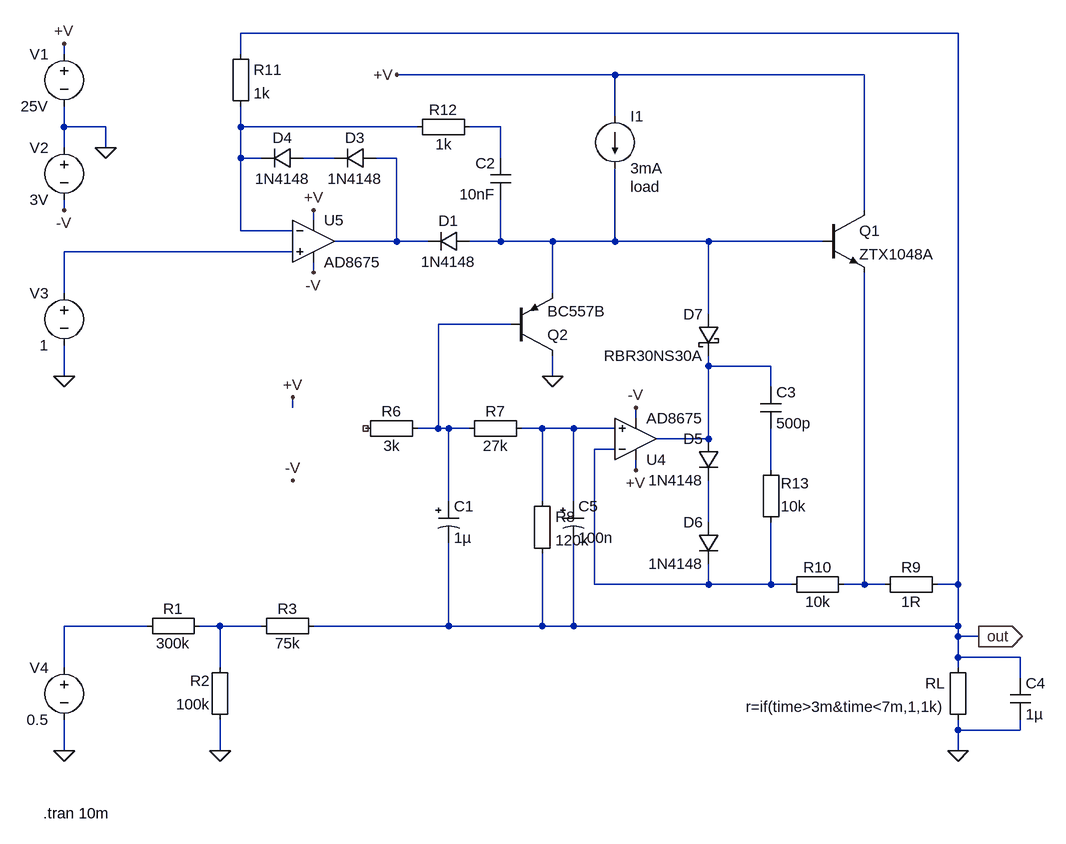
[diagram p0: schematic PSU CV CI high side I ref_ad8476.asc]
PSU CV CI high side I ref_ad8476.asc, the LTspice schematic file:
Version 4
SHEET 1 1452 1084
WIRE 1264 -208 160 -208
WIRE -112 -176 -112 -192
WIRE 160 -176 160 -208
WIRE 736 -144 400 -144
WIRE 1120 -144 736 -144
WIRE 736 -80 736 -144
WIRE -112 -64 -112 -96
WIRE -48 -64 -112 -64
WIRE 160 -64 160 -96
WIRE 432 -64 160 -64
WIRE 560 -64 512 -64
WIRE -112 -32 -112 -64
WIRE -48 -32 -48 -64
WIRE 160 -16 160 -64
WIRE 192 -16 160 -16
WIRE 304 -16 256 -16
WIRE 400 -16 368 -16
WIRE 560 -16 560 -64
WIRE -112 64 -112 48
WIRE 1120 64 1120 -144
WIRE 272 80 272 64
WIRE 160 96 160 -16
WIRE 240 96 160 96
WIRE 400 112 400 -16
WIRE 400 112 304 112
WIRE 448 112 400 112
WIRE 560 112 560 48
WIRE 560 112 512 112
WIRE 640 112 560 112
WIRE 736 112 736 0
WIRE 736 112 640 112
WIRE 880 112 736 112
WIRE 1056 112 880 112
WIRE 240 128 -112 128
WIRE 272 160 272 144
WIRE -112 192 -112 128
WIRE 640 192 640 112
WIRE 880 224 880 112
WIRE 576 240 464 240
WIRE 880 304 880 288
WIRE 976 304 880 304
WIRE -112 320 -112 272
WIRE 640 320 640 288
WIRE 976 336 976 304
WIRE 240 368 240 352
WIRE 768 384 768 368
WIRE 464 400 464 240
WIRE 464 400 432 400
WIRE 480 400 464 400
WIRE 512 400 480 400
WIRE 624 400 592 400
WIRE 672 400 624 400
WIRE 736 400 672 400
WIRE 880 416 880 304
WIRE 880 416 800 416
WIRE 736 432 704 432
WIRE 768 464 768 448
WIRE 976 464 976 400
WIRE 480 512 480 400
WIRE 624 512 624 400
WIRE 672 512 672 400
WIRE 880 544 880 480
WIRE 704 640 704 432
WIRE 880 640 880 608
WIRE 880 640 704 640
WIRE 976 640 976 544
WIRE 976 640 880 640
WIRE 1008 640 976 640
WIRE 1120 640 1120 160
WIRE 1120 640 1088 640
WIRE 1152 640 1120 640
WIRE 1264 640 1264 -208
WIRE 1264 640 1232 640
WIRE 16 704 -112 704
WIRE 128 704 96 704
WIRE 192 704 128 704
WIRE 480 704 480 576
WIRE 480 704 272 704
WIRE 624 704 624 592
WIRE 624 704 480 704
WIRE 672 704 672 576
WIRE 672 704 624 704
WIRE 1264 704 1264 640
WIRE 1264 704 672 704
WIRE 1264 720 1264 704
WIRE 1296 720 1264 720
WIRE 1264 752 1264 720
WIRE 1360 752 1264 752
WIRE -112 768 -112 704
WIRE 128 768 128 704
WIRE 1264 768 1264 752
WIRE 1360 784 1360 752
WIRE 1264 864 1264 848
WIRE 1360 864 1360 848
WIRE 1360 864 1264 864
WIRE -112 896 -112 848
WIRE 128 896 128 848
WIRE 1264 896 1264 864
FLAG -48 -32 0
FLAG -112 -192 +V
FLAG 272 64 +V
FLAG 400 -144 +V
FLAG -112 320 0
FLAG 240 352 +V
FLAG -112 896 0
FLAG 640 320 0
FLAG 768 464 +V
FLAG 1264 896 0
FLAG 128 896 0
FLAG -112 64 -V
FLAG 240 480 -V
FLAG 272 160 -V
FLAG 768 368 -V
FLAG 1296 720 out
IOPIN 1296 720 Out
SYMBOL npn 1056 64 R0
SYMATTR InstName Q1
SYMATTR Value ZTX1048A
SYMBOL voltage -112 -192 M0
WINDOW 123 0 0 Left 0
WINDOW 39 0 0 Left 0
SYMATTR InstName V1
SYMATTR Value 25V
SYMBOL Misc\\EuropeanResistor 1136 656 R270
WINDOW 0 27 56 VTop 2
WINDOW 3 5 56 VBottom 2
SYMATTR InstName R9
SYMATTR Value 1R
SYMBOL voltage -112 176 M0
WINDOW 123 0 0 Left 0
WINDOW 39 0 0 Left 0
SYMATTR InstName V3
SYMATTR Value 1
SYMBOL Misc\\EuropeanResistor 112 688 R90
WINDOW 0 5 56 VBottom 2
WINDOW 3 27 56 VTop 2
SYMATTR InstName R1
SYMATTR Value 300k
SYMBOL Misc\\EuropeanResistor 176 720 R270
WINDOW 0 27 56 VTop 2
WINDOW 3 5 56 VBottom 2
SYMATTR InstName R3
SYMATTR Value 75k
SYMBOL Misc\\EuropeanPolcap 464 512 R0
SYMATTR InstName C1
SYMATTR Value 1µ
SYMATTR SpiceLine Rser=100m
SYMBOL voltage -112 752 M0
WINDOW 123 0 0 Left 0
WINDOW 39 0 0 Left 0
SYMATTR InstName V4
SYMATTR Value 0.5
SYMBOL Misc\\EuropeanResistor 336 416 R270
WINDOW 0 27 56 VTop 2
WINDOW 3 5 56 VBottom 2
SYMATTR InstName R6
SYMATTR Value 3k
SYMBOL Misc\\EuropeanResistor 608 384 R90
WINDOW 0 5 56 VBottom 2
WINDOW 3 27 56 VTop 2
SYMATTR InstName R7
SYMATTR Value 27k
SYMBOL Misc\\EuropeanResistor 608 496 R0
SYMATTR InstName R8
SYMATTR Value 120k
SYMBOL pnp 576 288 M180
WINDOW 0 56 32 Left 2
WINDOW 3 56 68 Left 2
SYMATTR InstName Q2
SYMATTR Value BC557B
SYMBOL diode 512 96 R90
WINDOW 0 0 32 VBottom 2
WINDOW 3 32 32 VTop 2
SYMATTR InstName D1
SYMATTR Value 1N4148
SYMBOL current 736 -80 R0
WINDOW 123 0 0 Left 0
WINDOW 39 24 108 Left 2
SYMATTR SpiceLine load
SYMATTR InstName I1
SYMATTR Value 3mA
SYMBOL Misc\\EuropeanResistor 1280 752 M0
SYMATTR InstName RL
SYMATTR Value r=if(time>3m&time<7m,1,1k)
SYMBOL Misc\\EuropeanResistor 144 864 R180
WINDOW 0 31 76 Left 2
WINDOW 3 31 40 Left 2
SYMATTR InstName R2
SYMATTR Value 100k
SYMBOL voltage -112 -48 M0
WINDOW 123 0 0 Left 0
WINDOW 39 0 0 Left 0
SYMATTR InstName V2
SYMATTR Value 3V
SYMBOL diode 368 -32 R90
WINDOW 0 0 32 VBottom 2
WINDOW 3 32 32 VTop 2
SYMATTR InstName D3
SYMATTR Value 1N4148
SYMBOL Misc\\EuropeanResistor 144 -192 R0
SYMATTR InstName R11
SYMATTR Value 1k
SYMBOL diode 256 0 M270
WINDOW 0 32 32 VTop 2
WINDOW 3 0 32 VBottom 2
SYMATTR InstName D4
SYMATTR Value 1N4148
SYMBOL Misc\\EuropeanResistor 1104 624 R90
WINDOW 0 5 56 VBottom 2
WINDOW 3 27 56 VTop 2
SYMATTR InstName R10
SYMATTR Value 10k
SYMBOL cap 576 48 R180
WINDOW 0 24 56 Left 2
WINDOW 3 24 8 Left 2
SYMATTR InstName C2
SYMATTR Value 10nF
SYMBOL Misc\\EuropeanResistor 528 -80 R90
WINDOW 0 5 56 VBottom 2
WINDOW 3 27 56 VTop 2
SYMATTR InstName R12
SYMATTR Value 1k
SYMBOL cap 960 400 M180
WINDOW 0 24 56 Left 2
WINDOW 3 24 8 Left 2
SYMATTR InstName C3
SYMATTR Value 500p
SYMBOL Misc\\EuropeanResistor 960 560 M180
WINDOW 0 31 76 Left 2
WINDOW 3 31 40 Left 2
SYMATTR InstName R13
SYMATTR Value 10k
SYMBOL diode 896 416 M0
SYMATTR InstName D5
SYMATTR Value 1N4148
SYMBOL diode 896 544 M0
SYMATTR InstName D6
SYMATTR Value 1N4148
SYMBOL Opamps\\AD8675 768 480 M180
SYMATTR InstName U4
SYMBOL Opamps\\AD8675 272 48 R0
SYMATTR InstName U5
SYMBOL cap 1344 784 R0
SYMATTR InstName C4
SYMATTR Value 1µ
SYMBOL Misc\\EuropeanPolcap 656 512 R0
SYMATTR InstName C5
SYMATTR Value 100n
SYMATTR SpiceLine Rser=100m
SYMBOL schottky 896 224 M0
SYMATTR InstName D7
SYMATTR Value RBR30NS30A
SYMATTR Description Diode
SYMATTR Type diode
TEXT -144 992 Left 2 !.tran 10m

The netlist it stands for:
* PSU CV CI high side I ref_ad8476.asc
Q1 +V N005 N013 0 ZTX1048A
V1 +V 0 25V
R9 N013 out 1R
V3 N006 0 1
R1 N015 N014 300k
R3 N015 out 75k
C1 N007 out 1µ Rser=100m
V4 N014 0 0.5
R6 NC_01 N007 3k
R7 N009 N007 27k
R8 N009 out 120k
Q2 0 N007 N005 0 BC557B
D1 N005 N004 1N4148
I1 +V N005 3mA load
RL out 0 r=if(time>3m&time<7m,1,1k)
R2 0 N015 100k
V2 0 -V 3V
D3 N004 N003 1N4148
R11 out N001 1k
D4 N003 N001 1N4148
R10 N013 N010 10k
C2 N005 N002 10nF
R12 N002 N001 1k
C3 N011 N008 500p
R13 N010 N011 10k
D5 N008 N012 1N4148
D6 N012 N010 1N4148
XU4 N009 N010 +V -V N008 AD8675  ; pins In+ In- V+ V- OUT
XU5 N006 N001 +V -V N004 AD8675  ; pins In+ In- V+ V- OUT
C4 out 0 1µ
C5 N009 out 100n Rser=100m
D7 N005 N008 RBR30NS30A
.model D D
.lib standard.dio
.model NPN NPN
.model PNP PNP
.lib standard.bjt
.tran 10m
.backanno
.end